# EAGLE schematic Main_Board (EAGLE 7.6.0)
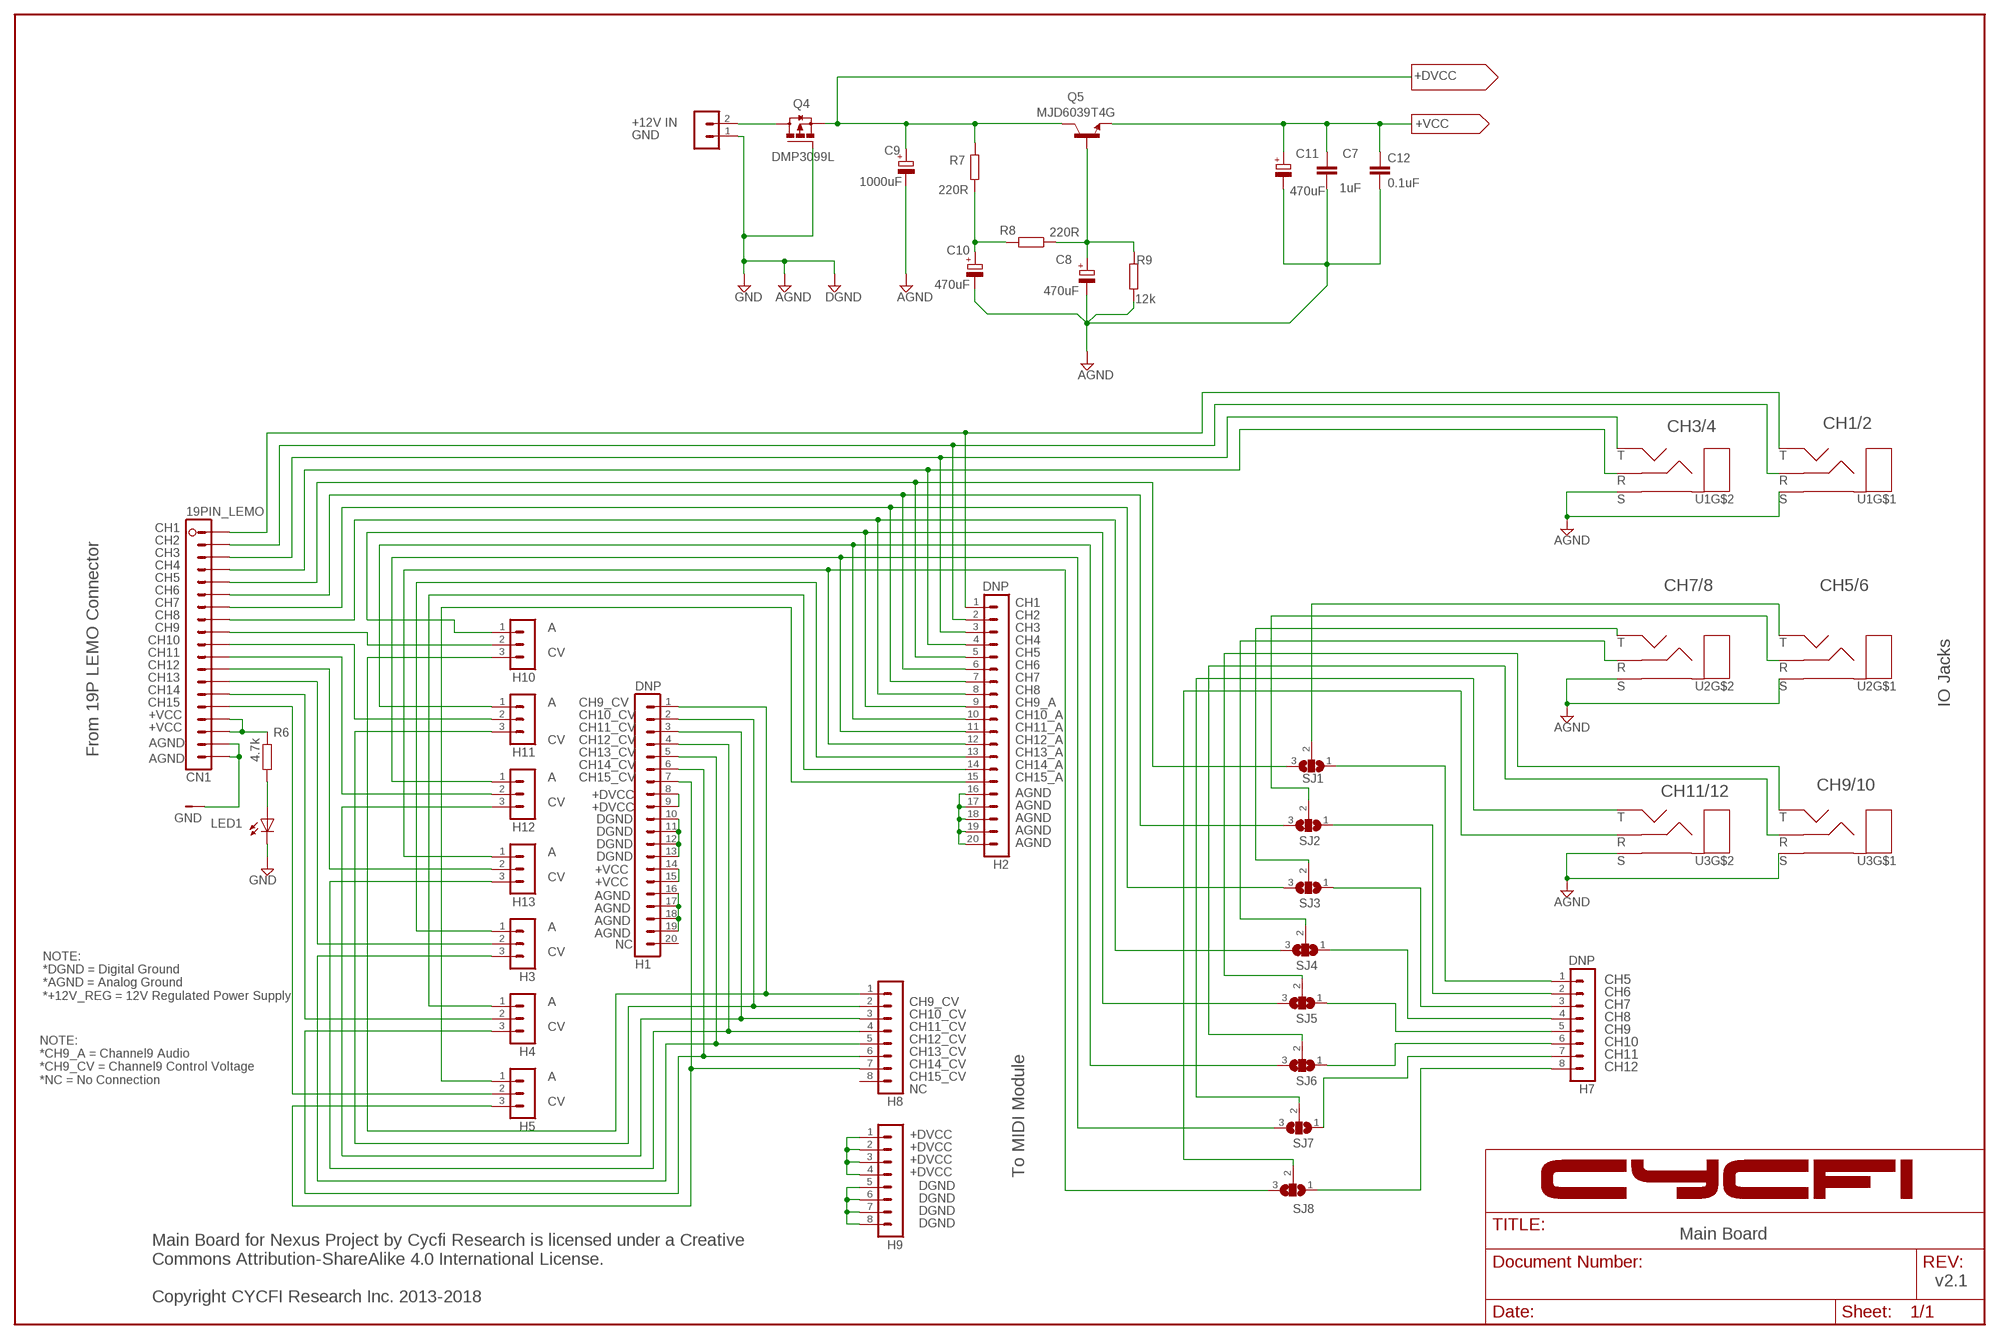
[diagram p0: schematic, sheet 1]

## Parts
C7  1uF  C-EUC0603  [C0603]
C8  470uF  CPOL-EU140CLH-1010  [140CLH-1010]
C9  1000uF  CPOL-EU140CLH-1010  [140CLH-1010]
C10  470uF  CPOL-EU140CLH-1010  [140CLH-1010]
C11  470uF  CPOL-EU140CLH-1010  [140CLH-1010]
C12  0.1uF  C-EUC0402  [C0402]
CN1  19PIN_LEMO  [19PIN_LEMO]
GND  TH-PAD-1.6/0.8  [TH-PAD-1.6/0.8]
H1  DNP  MA20-1  [MA20-1]
H2  DNP  MA20-1  [MA20-1]
H3  MA03-1_EDITED  [MA03-1_]
H4  MA03-1_EDITED  [MA03-1_]
H5  MA03-1_EDITED  [MA03-1_]
H6  MA02-1  [MA02-1]
H7  DNP  MA08-1  [MA08-1]
H8  MA08-1  [MA08-1]
H9  MA08-1  [MA08-1]
H10  MA03-1_EDITED  [MA03-1_]
H11  MA03-1_EDITED  [MA03-1_]
H12  MA03-1_EDITED  [MA03-1_]
H13  MA03-1_EDITED  [MA03-1_]
LED1  LED3MM  [LED3MM]
Q4  DMP3099L  P_MOSFET  [SOT23]
Q5  MJD6039T4G  DSS60601MZ4-13  [SOT-223-4]
R6  4.7k  R-EU_R0402  [R0402]
R7  220R  R-EU_R0402  [R0402]
R8  220R  R-EU_R0402  [R0402]
R9  12k  R-EU_R0402  [R0402]
SJ1  SJ2W  [SJ_2]
SJ2  SJ2W  [SJ_2]
SJ3  SJ2W  [SJ_2]
SJ4  SJ2W  [SJ_2]
SJ5  SJ2W  [SJ_2]
SJ6  SJ2W  [SJ_2]
SJ7  SJ2W  [SJ_2]
SJ8  SJ2W  [SJ_2]
U1  AGND  NSJ12HC  [NSJ12HC]
U2  AGND  NSJ12HC  [NSJ12HC]
U3  AGND  NSJ12HC  [NSJ12HC]

## Nets
+DVCC: C9.+ H1.8 H1.9 H9.1 H9.2 H9.3 H9.4 Q4.2(S) Q5.P$2(C) Q5.P$4(C) R7.2
+VCC: C7.1 C11.+ C12.1 CN1.P$16 CN1.P$17 H1.14 H1.15 Q5.P$3(E) R6.1
AGND: U1.G(DGND) U1.SB(S) U1.ST(S) U2.G(DGND) U2.SB(S) U2.ST(S)
DGND: H9.5 H9.6 H9.7 H9.8 U3.G(DGND) U3.SB(S) U3.ST(S)
GND: C7.2 C8.- C9.- C10.- C11.- C12.2 CN1.P$18 CN1.P$19 GND.1(P) H1.10 H1.11 H1.12 H1.13 H1.16 H1.17 H1.18 H1.19 H2.16 H2.17 H2.18 H2.19 H2.20 H6.1 LED1.K(C) Q4.1(G) R9.1 ; supply symbol labelled AGND, DGND
N$1: CN1.P$2 H2.2 U1.RT(R)
N$2: SJ1.2 U2.TT(T)
N$3: SJ2.2 U2.RT(R)
N$4: H6.2 Q4.3(D)
N$5: SJ3.2 U2.TB(T)
N$6: C8.+ Q5.P$1(B) R8.1 R9.2
N$7: SJ4.2 U2.RB(R)
N$8: C10.+ R7.1 R8.2
N$9: CN1.P$5 H2.5 SJ1.3
N$11: CN1.P$7 H2.7 SJ3.3
N$13: H1.1 H8.1 H10.3
N$14: CN1.P$10 H11.2
N$15: CN1.P$11 H12.2
N$16: CN1.P$12 H13.2
N$17: CN1.P$9 H10.2
N$18: H2.10 H11.1 SJ6.3
N$19: H2.13 H3.1
N$20: SJ5.2 U3.TT(T)
N$21: H2.14 H4.1
N$22: H2.15 H5.1
N$23: CN1.P$1 H2.1 U1.TT(T)
N$24: SJ6.2 U3.RT(R)
N$25: LED1.A R6.2
N$26: H1.3 H8.3 H12.3
N$27: H1.2 H8.2 H11.3
N$28: H2.12 H13.1 SJ8.3
N$29: H2.11 H12.1 SJ7.3
N$30: H1.4 H8.4 H13.3
N$31: CN1.P$3 H2.3 U1.TB(T)
N$32: H2.9 H10.1 SJ5.3
N$33: H1.5 H3.3 H8.5
N$34: H1.6 H4.3 H8.6
N$35: H1.7 H5.3 H8.7
N$36: CN1.P$13 H3.2
N$37: CN1.P$14 H4.2
N$38: CN1.P$15 H5.2
N$39: CN1.P$4 H2.4 U1.RB(R)
N$40: SJ7.2 U3.TB(T)
N$41: CN1.P$6 H2.6 SJ2.3
N$42: SJ8.2 U3.RB(R)
N$43: CN1.P$8 H2.8 SJ4.3
N$44: H7.1 SJ1.1
N$45: H7.2 SJ2.1
N$46: H7.3 SJ3.1
N$47: H7.4 SJ4.1
N$48: H7.5 SJ5.1
N$49: H7.6 SJ6.1
N$50: H7.7 SJ7.1
N$51: H7.8 SJ8.1
Unconnected: H1.20 H8.8

## Notes on the sheet
- +12V IN
- GND
- CH3/4 | CH1/2
- CH1
- CH2
- CH3
- CH4
- CH5
- CH6 | CH7/8 | CH5/6
- CH7 | CH1
- CH8 | CH2
- CH9 | A | CH3
- CH10 | CH4
- CH11 | CV | CH5
- CH12 | CH6
- CH13 | CH7
- CH14 | CH8
- CH15 | A | CH9_CV | CH9_A | IO Jacks
- +VCC | CH10_CV | CH10_A
- +VCC | CH11_CV | CH11_A
- AGND | CV | CH12_CV | CH12_A
- From 19P LEMO Connector | CH13_CV | CH13_A
- AGND
- CH14_CV | CH14_A
- A | CH15_CV | CH15_A
- CH9/10
- +DVCC | AGND | CH11/12
- CV | AGND
- +DVCC | DGND
- AGND
- DGND
- AGND
- DGND
- AGND
- DGND
- A
- +VCC
- CV
- +VCC
- AGND
- AGND
- AGND
- A
- AGND
- NC
- CV
- CH5
- CH6
- NOTE:
  *DGND = Digital Ground
  *AGND = Analog Ground
  *+12V_REG = 12V Regulated Power Supply
- A | CH9_CV | CH7
- CH10_CV | CH8
- CV | CH11_CV | CH9
- CH12_CV | CH10
- CH13_CV | CH11
- CH14_CV | CH12
- A | CH15_CV
- NOTE:
  *CH9_A = Channel9 Audio
  *CH9_CV = Channel9 Control Voltage
  *NC = No Connection
- NC
- CV
- +DVCC
- +DVCC
- +DVCC
- +DVCC | To MIDI Module
- DGND
- DGND
- DGND
- DGND
- Main Board
- v2.1
- Main Board for Nexus Project by Cycfi Research is licensed under a Creative
  Commons Attribution-ShareAlike 4.0 International License.
  
  Copyright CYCFI Research Inc. 2013-2018

## Library data of the parts
C7 C12 = resistor:C-EU: CAPACITOR, European symbol
C8-C11 = resistor:CPOL-EU: POLARIZED CAPACITOR, European symbol
CN1 = CYCFI_Con:19PIN_LEMO
GND = CYCFI_Con:TH-PAD-1.6/0.8
H1 H2 = con-lstb:MA20-1: PIN HEADER; OC_FARNELL: unknown; OC_NEWARK: unknown
H3-H5 H10-H13 = con-lstb:MA03-1: PIN HEADER
H6 = con-lstb:MA02-1
H7-H9 = con-lstb:MA08-1: PIN HEADER; OC_FARNELL: unknown; OC_NEWARK: unknown
LED1 = led:LED: LED OSRAM: - CHIPLED LG R971, LG N971, LY N971, LG Q971, LY Q971, LO R971, LY R971 LH N974, LH R974 LS Q976, LO Q976, LY Q976 LO Q996 - Hyper CHIPLED LW Q18S LB Q993, LB Q99A, LB R99A - SideLED LS A670, LO A670, LY A670, LG A670, LP A670 LB A673, LV A673, LT A673, LW A673 LH A674 LY A675 LS A676, LA A676, LO A676, LY A676, LW A676 LS A679, LY A679, LG A679 - Hyper Micro SIDELED® LS Y876, LA Y876, LO Y876, LY Y876 LT Y87S - SmartLED LW L88C, LW L88S LB L89C, LB L89S, LG L890 LS L89K, LO L89K, LY L89K LS L896, LA L896, LO L896, LY L896 - TOPLED LS T670, LO T670, LY T670, LG T670, LP T670 LSG T670, LSP T670, LSY T670, LOP T670, LYG T670 LG T671, LOG T671, LSG T671 LB T673, LV T673, LT T673, LW T673 LH T674 LS T676, LA T676, LO T676, LY T676, LB T676, LH T676, LSB T676, LW T676 LB T67C, LV T67C, LT T67C, LS T67K, LO T67K, LY T67K, LW E67C LS E67B, LA E67B, LO E67B, LY E67B, LB E67C, LV E67C, LT E67C LW T67C LS T679, LY T679, LG T679 LS T770, LO T770, LY T770, LG T770, LP T770 LB T773, LV T773, LT T773, LW T773 LH T774 LS E675, LA E675, LY E675, LS T675 LS T776, LA T776, LO T776, LY T776, LB T776 LHGB T686 LT T68C, LB T68C - Hyper Mini TOPLED® LB M676 - Mini TOPLED Santana® LG M470 LS M47K, LO M47K, LY M47K Source: http://www.osram.convergy.de LUXEON: - LUMILED® LXK2-PW12-R00, LXK2-PW12-S00, LXK2-PW14-U00, LXK2-PW14-V00 LXK2-PM12-R00, LXK2-PM12-S00, LXK2-PM14-U00 LXK2-PE12-Q00, LXK2-PE12-R00, LXK2-PE12-S00, LXK2-PE14-T00, LXK2-PE14-U00 LXK2-PB12-K00, LXK2-PB12-L00, LXK2-PB12-M00, LXK2-PB14-N00, LXK2-PB14-P00, LXK2-PB14-Q00 LXK2-PR12-L00, LXK2-PR12-M00, LXK2-PR14-Q00, LXK2-PR14-R00 LXK2-PD12-Q00, LXK2-PD12-R00, LXK2-PD12-S00 LXK2-PH12-R00, LXK2-PH12-S00 LXK2-PL12-P00, LXK2-PL12-Q00, LXK2-PL12-R00 Source: www.luxeon.com KINGBRIGHT: KA-3528ASYC Source: www.kingbright.com
Q4 = CYCFI_semicon:P_MOSFET
Q5 = CYCFI_semicon:DSS60601MZ4-13
R6-R9 = resistor:R-EU_: RESISTOR, European symbol
SJ1-SJ8 = jumper:SJ2W: SMD solder JUMPER
U1-U3 = CYCFI_Jack:NSJ12HC